# EAGLE design MINI_SAM_D51_015 (EAGLE 9.1.3)
BUILD: 2018/01; DESIGNER: BENJAMIN SHOCKLEY; REV: A
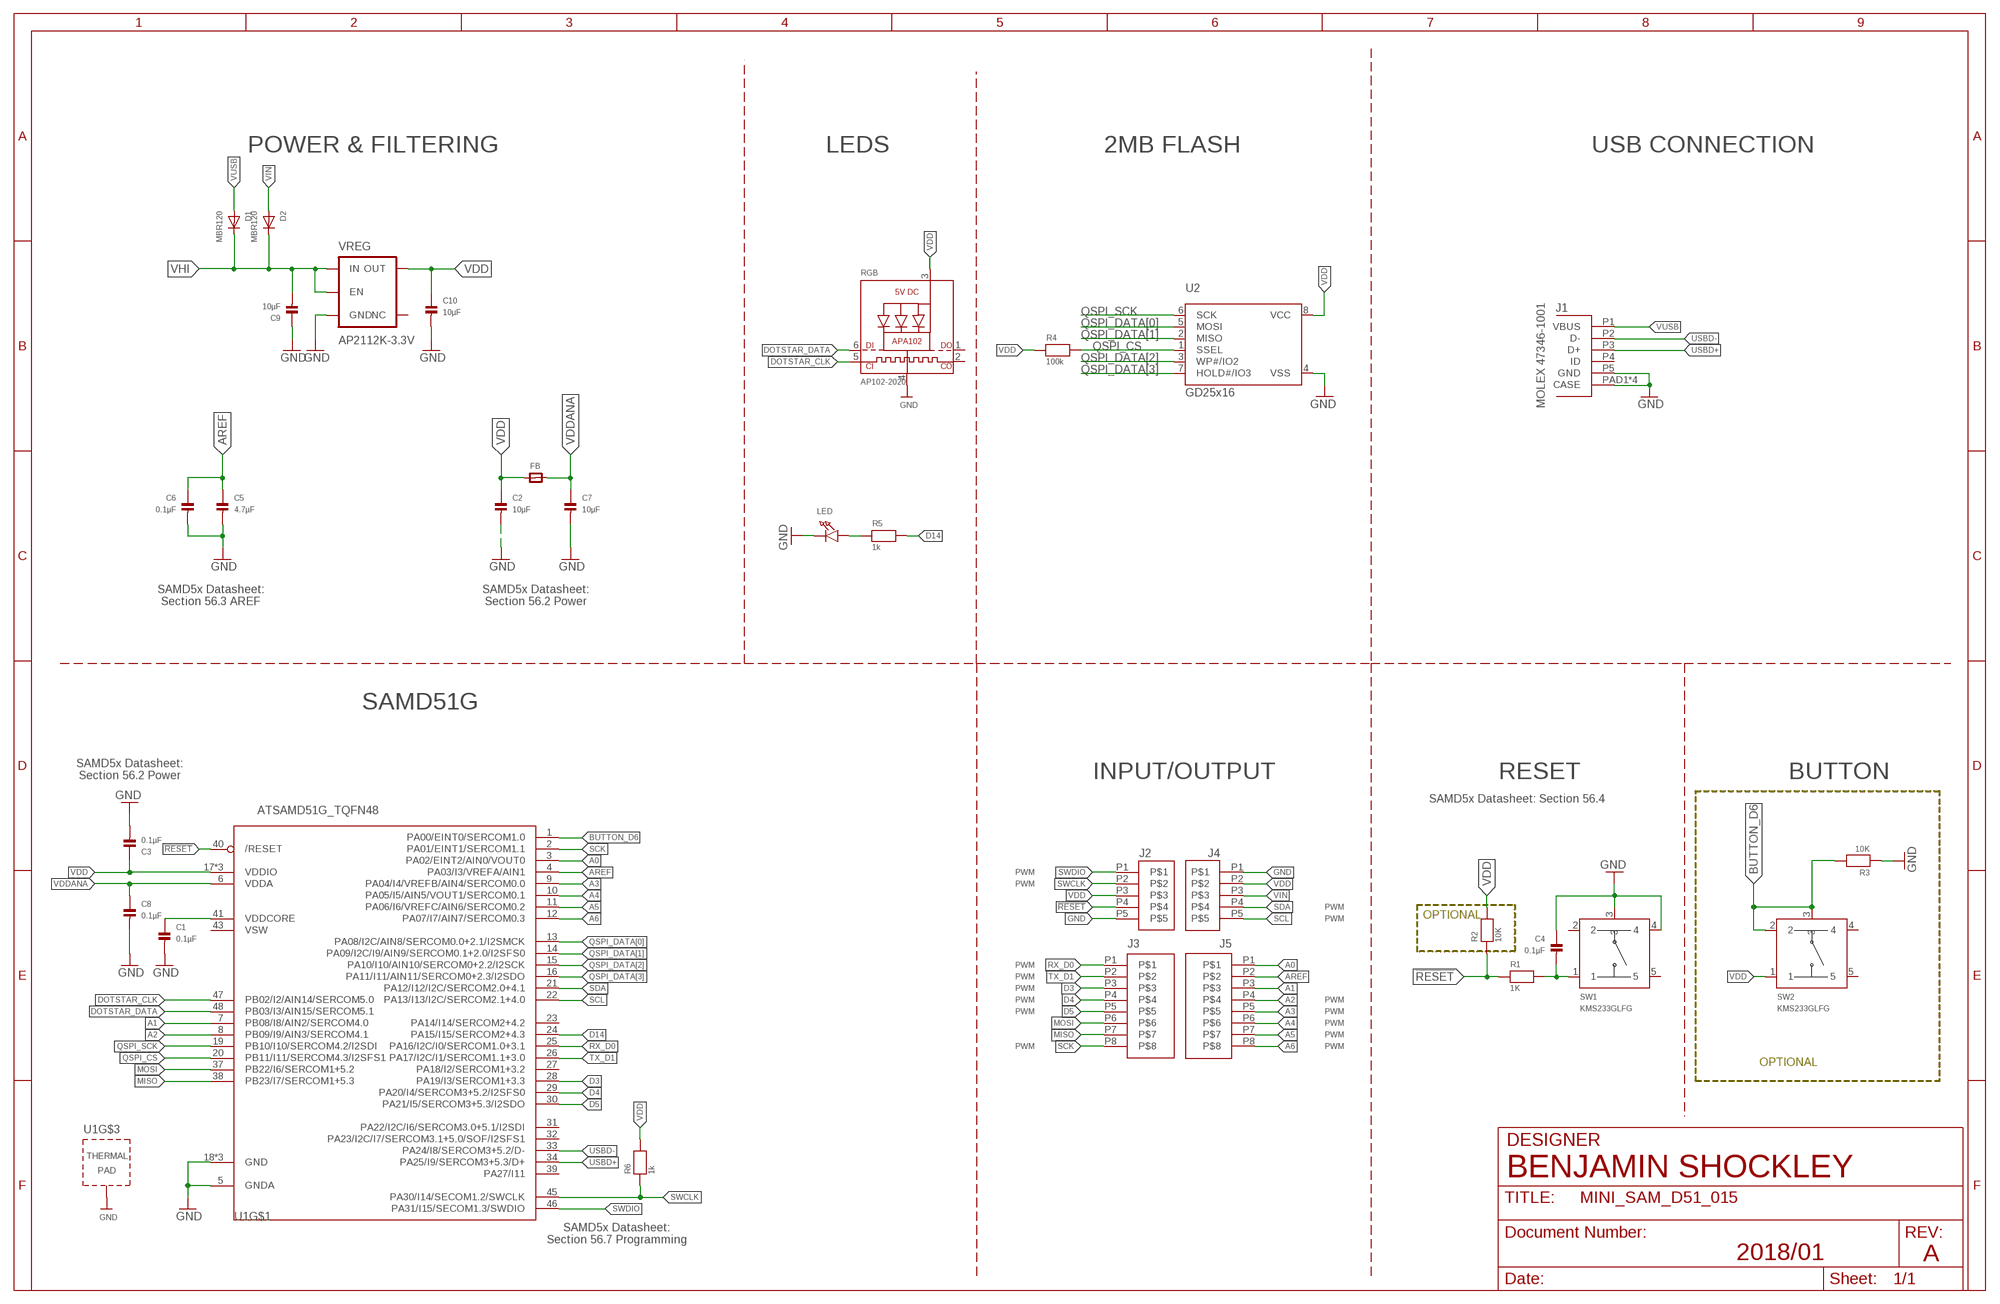
[diagram p0: schematic, sheet 1]

## Parts
C1  0.1µF  CAP_CERAMIC_0603MP  [_0603MP]
C2  10µF  CAP_CERAMIC_0603MP  [_0603MP]
C3  0.1µF  CAP_CERAMIC_0603MP  [_0603MP]
C4  0.1µF  CAP_CERAMIC_0603MP  [_0603MP]
C5  4.7µF  CAP_CERAMIC_0603MP  [_0603MP]
C6  0.1µF  CAP_CERAMIC_0603MP  [_0603MP]
C7  10µF  CAP_CERAMIC_0603MP  [_0603MP]
C8  0.1µF  CAP_CERAMIC_0603MP  [_0603MP]
C9  10µF  CAP_CERAMIC_0603MP  [_0603MP]
C10  10µF  CAP_CERAMIC_0603MP  [_0603MP]
D1  MBR120  DIODE_SOD-123FL  [SOD-123FL]
D2  MBR120  DIODE_SOD-123FL  [SOD-123FL]
FB  FERRITE_0603MP  [_0603MP]
J1  MOLEX_47346-100147346  [MOLEX_47346-1001]
J2  1X5_HEADER_1.27MMCAST  [1X5_HEADER_1.27MM_CASTELLATED]
J3  1X8_HEADER_1.27MMCAST  [1X8_HEADER_1.27MM_CASTELLATED]
J4  1X5_HEADER_1.27MMCAST  [1X5_HEADER_1.27MM_CASTELLATED]
J5  1X8_HEADER_1.27MMCAST  [1X8_HEADER_1.27MM_CASTELLATED]
LED  LED0805_NOOUTLINE  [CHIPLED_0805_NOOUTLINE]
R1  1K  RESISTOR_0603MP  [_0603MP]
R2  10K  RESISTOR_0603MP  [_0603MP]
R3  10K  RESISTOR_0603MP  [_0603MP]
R4  100k  RESISTOR_0603MP  [_0603MP]
R5  1k  RESISTOR_0603MP  [_0603MP]
R6  1k  RESISTOR_0603MP  [_0603MP]
RGB  AP102-2020  APA1022020  [APA102_2020]
SW1  KMS233GLFG  KMS_SWITCHKMS  [KMS_SWITCH]
SW2  KMS233GLFG  KMS_SWITCHKMS  [KMS_SWITCH]
U1  ATSAMD51G_TQFN48  [TQFN48_7MM]
U2  GD25x16  SPIFLASH_8PINUX  [USON8]
VREG  AP2112K-3.3V  V_REG_AP2112K-3.3V  [SOT23-5]

## Nets
!RESET: J2.P4 R1.1 R2.1 U1.40(/RESET)
A0: J5.P1 U1.3(PA02/EINT2/AIN0/VOUT0)
A1: J5.P3 U1.7(PB08/I8/AIN2/SERCOM4.0)
A2: J5.P4 U1.8(PB09/I9/AIN3/SERCOM4.1)
A3: J5.P5 U1.9(PA04/I4/VREFB/AIN4/SERCOM0.0)
A4: J5.P6 U1.10(PA05/I5/AIN5/VOUT1/SERCOM0.1)
A5: J5.P7 U1.11(PA06/I6/VREFC/AIN6/SERCOM0.2)
A6: J5.P8 U1.12(PA07/I7/AIN7/SERCOM0.3)
AREF: C5.1 C6.1 J5.P2 U1.4(PA03/I3/VREFA/AIN1)
BUTTON_D6: R3.2 SW2.2 SW2.3 U1.1(PA00/EINT0/SERCOM1.0)
D3: J3.P3 U1.28(PA19/I3/SERCOM1+3.3)
D4: J3.P4 U1.29(PA20/I4/SERCOM3+5.2/I2SFS0)
D5: J3.P5 U1.30(PA21/I5/SERCOM3+5.3/I2SDO)
D14: R5.2 U1.24(PA15/I15/SERCOM2+4.3)
DOTSTAR_CLK: RGB.5(CKI) U1.47(PB02/I2/AIN14/SERCOM5.0)
DOTSTAR_DATA: RGB.6(DI) U1.48(PB03/I3/AIN15/SERCOM5.1)
GND: C1.2 C2.2 C3.2 C4.1 C5.2 C6.2 C7.2 C8.2 C9.1 C10.2 J1.P5(GND) J1.PAD1(CASE) J1.PAD2(CASE) J1.PAD3(CASE) J1.PAD4(CASE) J2.P5 J4.P1 LED.C R3.1 RGB.4(GND) SW1.3 SW1.4 U1.5(GNDA) U1.18(GND) U1.35(GND) U1.42(GND) U1.THERMAL(TP) U2.4(VSS) VREG.2(GND)
MISO: J3.P7 U1.38(PB23/I7/SERCOM1+5.3)
MOSI: J3.P6 U1.37(PB22/I6/SERCOM1+5.2)
N$3: LED.A R5.1
N$4: C4.2 R1.2 SW1.1
N$9: C1.1 U1.41(VDDCORE)
QSPI_CS: R4.2 U1.20(PB11/I11/SERCOM4.3/I2SFS1) U2.1(SSEL)
QSPI_DATA[0]: U1.13(PA08/I2C/AIN8/SERCOM0.0+2.1/I2SMCK) U2.5(MOSI)
QSPI_DATA[1]: U1.14(PA09/I2C/I9/AIN9/SERCOM0.1+2.0/I2SFS0) U2.2(MISO)
QSPI_DATA[2]: U1.15(PA10/I10/AIN10/SERCOM0+2.2/I2SCK) U2.3(WP#/IO2)
QSPI_DATA[3]: U1.16(PA11/I11/AIN11/SERCOM0+2.3/I2SDO) U2.7(HOLD#/IO3)
QSPI_SCK: U1.19(PB10/I10/SERCOM4.2/I2SDI) U2.6(SCK)
RX_D0: J3.P1 U1.25(PA16/I2C/I0/SERCOM1.0+3.1)
SCK: J3.P8 U1.2(PA01/EINT1/SERCOM1.1)
SCL: J4.P5 U1.22(PA13/I13/I2C/SERCOM2.1+4.0)
SDA: J4.P4 U1.21(PA12/I12/I2C/SERCOM2.0+4.1)
SWCLK: J2.P2 R6.1 U1.45(PA30/I14/SECOM1.2/SWCLK)
SWDIO: J2.P1 U1.46(PA31/I15/SECOM1.3/SWDIO)
TX_D1: J3.P2 U1.26(PA17/I2C/I1/SERCOM1.1+3.0)
USBD+ [USB_DATA]: J1.P3(D+) U1.34(PA25/I9/SERCOM3+5.3/D+)
USBD- [USB_DATA]: J1.P2(D-) U1.33(PA24/I8/SERCOM3+5.2/D-)
VDD: C2.1 C3.1 C10.1 FB.1 J2.P3 J4.P2 R2.2 R4.1 R6.2 RGB.3(VDD) SW2.1 U1.17(VDDIO) U1.36(VDDIO) U1.44(VDDIO) U2.8(VCC) VREG.5(OUT)
VDDANA: C7.1 C8.1 FB.2 U1.6(VDDA)
VHI: C9.2 D1.C D2.C VREG.1(IN) VREG.3(EN)
VIN: D2.A J4.P3
VUSB: D1.A J1.P1(VBUS)
Unconnected: J1.P4(ID) RGB.1(DO) RGB.2(CKO) SW1.2 SW1.5 SW2.4 SW2.5 U1.23(PA14/I14/SERCOM2+4.2) U1.27(PA18/I2/SERCOM1+3.2) U1.31(PA22/I2C/I6/SERCOM3.0+5.1/I2SDI) U1.32(PA23/I2C/I7/SERCOM3.1+5.0/SOF/I2SFS1) U1.39(PA27/I11) VREG.4(NC)

## Notes on the sheet
- POWER & FILTERING | LEDS | 2MB FLASH | USB CONNECTION
- MOLEX 47346-1001
- SAMD5x Datasheet:
  Section 56.3 AREF
- SAMD5x Datasheet:
  Section 56.2 Power
- SAMD51G
- SAMD5x Datasheet:
  Section 56.2 Power
- INPUT/OUTPUT | RESET | BUTTON
- SAMD5x Datasheet: Section 56.4
- SPI:
   SERCOM1  SCK.1, MOSI.2, MISO.3
  
  I2C:
   SERCOM2  SDA.0, SCL.1
  
  UART:
   SERCOM3  TX.0, RX.1
- PWM
- PWM
- PWM
- OPTIONAL
- PWM
- PWM
- PWM
- PWM
- PWM | PWM
- PWM | PWM
- PWM
- PWM
- PWM | PWM
- OPTIONAL
- DESIGNER
- SAMD5x Datasheet:
  Section 56.7 Programming

## Power pins joined to a net without a drawn wire
VSW: U1.43(VSW)

## Library data of the parts
C1-C10 = microbuilder:CAP_CERAMIC: Ceramic Capacitors 0402 - 0402 Surface Mount Capacitors 16pF 50V 5% [Digikey: 445-4899-2-ND] 18pF 50V 5% [Digikey: 490-1281-2-ND] 22pF 50V 5% [Digikey: 490-1283-2-ND] 68pF 50V 5% [Digikey: 490-1289-2-ND] 0.1uF 10V 10% [Digikey: 490-1318-2-ND] 1.0uF 6.3V 10% [Digikey: 490-1320-2-ND] 0603 - 0603 Surface Mount Capacitors 16 pF 50V 5% [Digikey: 445-5051-2-ND] 22 pF 50V [Digikey: PCC220ACVTR-ND] 33 pF 50V 5% [Digikey: 490-1415-1-ND] 56pF 50V 5% [Digikey: 490-1421-1-ND] 220pF 50V 5% [Digikey: 445-1285-1-ND] 680 pF 50V 2200 pF 50V 5% C0G [Digikey: 445-1297-1-ND] 5600 pF 100V 5% X7R [Digikey: 478-3711-1-ND] 0.1 µF 25V 10% [Digikey: PCC2277TR-ND] 0.22 µF 16V 10% X7R [Digikey: 445-1318-1-ND] 1.0 µF 25V 10% [Digikey: 445-5146-2-ND] 0603 - RF Specific 3pF 250V +/-0.1pF RF [Digikey: 712-1347-1-ND] 18 pF 250V 5% [Digikey: 478-3505-1-ND or 712-1322-1-ND] 56 pF 250V 5% C0G RF [Digikey: 490-4867-1-ND] 68 pF 250V RF [Digikey: 490-4868-1-ND] 0805 - 0805 Surface Mount Capacitors 220 pF 250V 2% RF Ceramic Capacitor [Digikey: 712-1398-1-ND] 1000 pF 50V 2% NP0 Ceramic Capacitor [Digikey: 478-3760-1-ND] 0.1 µF 25V 10% Ceramic Capacitor [Digikey: PCC1828TR-ND] 1.0 µF 16V 10% Ceramic Capacitor[Digikey: 490-1691-2-ND] 10.0 µF 10V 10% Ceramic Capacitor[Digikey: 709-1228-1-ND] 10.0 uF 16V 10% Ceramic Capacitor [Digikey: 478-5165-2-ND] 47 uF 6.3V 20% Ceramic Capacitor [Digikey: 587-1779-1-ND or 399-5506-1-ND] 1206 - 1206 Surface Mount Capacitors 47uF 10V 20% Ceramic Capacitor [Digikey: 490-5528-1-ND or 399-5508-1-ND or 445-6010-1-ND] 100uF 6.3V -20%, +80% Y5V Ceramic Capacitor (Digikey: 490-4512-1-ND, Mouser: 81-GRM31CF50J107ZE1L)
D1 D2 = adafruit:DIODE: Diode SMADIODE - SMA Surface Mount Package 20V 1A Schottky Diode Digikey: 641-1014-6-ND DO-1N4148 - Through Hole Small Current Diode SOD-123 20V 1 A (.5mV Vf) Schottky Diode - Digikey: MBRX120TPMSCT-ND SOD-323 10V 570mA (.38mV Vf, 3ns) Schottky Diode - Digikey: ZLLS410CT-ND SOD-523 30V 30mA Schottky Diode (RB751S-40TE61) - Digikey: RB751S-40TE61CT-ND SOT23-R/W - SOT23 Package (R = Solder Paste/Reflow Ovens, W = Hand-Soldering) BAT54Film 40V 300mA - Digikey: 497-7162-1-ND
FB = microbuilder:FERRITE: Ferrite Bead 0603 MMZ1608B121C - 120 Ohm @ 100MHz, 600mA, 0.15 Ohm DC Resistance - Digikey: 445-2164-1-ND BK1608HW121-T - 120 Ohm, 600mA Ferrite Chip - Digikey: 587-1876-2-ND 0805 HZ0805B272R-10 - 2.7K Ohm @ 100MHz, 200mA, 0.8 Ohm DC Resistance - Digikey: 240-2504-1-ND (see also Murata BLM21BD272SN1L) MMZ2012Y152B - 1.5K Ohm @ 100MHz, 500mA, 0.4 Ohm DC Resistance - Digikey: 445-1560-1-ND - Mainly for high frequency (80-400MHz) MMZ2012R102A - 1K Ohm @ 100MHz, 500mA, 0.3 Ohm DC Resistance - Digikey: 445-1555-2-ND - More general purpose (10-200MHz)
J1 = Shockley_Custom:MOLEX_47346-1001
J2 J4 = Shockley_Custom:1X5_HEADER_1.27MM
J3 J5 = Shockley_Custom:1X8_HEADER_1.27MM
LED = microbuilder:LED: LED 0603 - 0603 Surface Mount Package 2mA: Green LED - Low Power (3.9mcd, 2ma, 1.7Vf) - Digikey: 475-2709-2-ND Orange LED - Low Power (9.8mcd, 2ma, 1.8Vf) - Digikey: 475-1194-2-ND Red LED - Low Power (5mcd, 2ma, 1.8Vf) - Digikey: 475-1195-2-ND Yellow LED - Low Power (7mcd, 2ma, 1.8Vf) - Digikey: 475-1196-2-ND 5mA: Blue LED - Low Power (17mcd, 5ma, 2.9Vf) - Digikey: LNJ937W8CRACT-ND 0805 - 0805 Surface Mount Package 2mA: Red LED (8.8mcd, 2mA, 1.8Vf, Clear) - Low Power [Digikey: 475-2510-1-ND] Green LED (5mcd, 2mA, 1.8Vf, Clear) - Low Power [Digikey: 475-2730-1-ND] Yellow LED (11.3mcd, 2mA, 1.8Vf, Clear) - Low Power [Digikey: 475-2555-1-ND] 20mA: Red LED (104mcd, 20mA, Diffused) - LS R976 [Digikey: 475-1278-6-ND] Red LED (12mcd, 20mA, 2.0Vf, Clear) - APT2012EC [Digikey: 754-1128-1-ND] Green LED (15mcd, 20mA, 2.2Vf, Clear) - APT2012GC [Digikey: 754-1131-1-ND] Orange LED (160mcd, 20mA, 2.1Vf, Clear) - APT2012SECK [Digikey: 754-1130-1-ND] 1206 - 1206 Surface Mount Package Green LED (26mcd, 20mA, Diffused) - LG N971 [Digikey: 475-1407-6-ND] Red LED (15mcd, 20mA, Diffused) - LH N974 [Digikey: 475-1416-6-ND]
R1-R6 = microbuilder:RESISTOR: Resistors 0402 - 0402 Surface Mount Package 22 Ohm 1% 1/16W [Digikey: 311-22.0LRTR-ND] 33 Ohm 5% 1/16W 1.0K 5% 1/16W 1.5K 5% 1/16W 2.0K 1% 1/16W 10.0K 1% 1/16W [Digikey: 311-10.0KLRTR-ND] 10.0K 5% 1/16W [Digikey: RMCF0402JT10K0TR-ND] 12.1K 1% 1/16W [Digikey: 311-22.0LRTR-ND] 100.0K 5% 1/16W 0603 - 0603 Surface Mount Package 0 Ohm 1/10 Watt 1% Resistor 15 Ohm 1/10 Watt 1% Resistor 33 Ohm 1/10 Watt 1% Resistor 49.9 Ohm 1/10 Watt 1% Resistor 100 Ohm 1/10 Watt 1% Resistor 150 Ohm 1/10 Watt 1% Resistor 240 Ohm 1/10 Watt 1% Resistor 390 Ohm 1/10 Watt 1% Resistor 560 Ohm 1/10 Watt 1% Resistor 680 Ohm 1/10 Watt 1% Resistor 750 Ohm 1/10 Watt 1% Resistor 1.0K Ohm 1/10 Watt 1% Resistor 1.5K Ohm 1/10 Watt 1% Resistor 2.0K Ohm 1/10 Watt 1% Resistor 2.2K Ohm 1/10 Watt 1% Resistor 3.3K Ohm 1/10 Watt 1% Resistor 4.7K Ohm 1/10 Watt 1% Resistor 10.0K Ohm 1/10 Watt 1% Resistor 12.0K Ohm 1/10 Watt 1% Resistor 12.1K Ohm 1/10 Watt 1% Resistor 20.0K Ohm 1/10 Watt 1% Resistor 33.0K Ohm 1/10 Watt 1% Resistor 100.0K Ohm 1/10 Watt 1% Resistor 0805 - 0805 Surface Mount Package 0 Ohm 1/8 Watt 1% Resistor 33 Ohm 1/8 Watt 1% Resistor 100 Ohm 1/8 Watt 1% Resistor 150 Ohm 1/8 Watt 1% Resistor 200 Ohm 1/8 Watt 1% Resistor 240 Ohm 1/8 Watt 1% Resistor 330 Ohm 1/8 Watt 1% Resistor 390 Ohm 1/8 Watt 1% Resistor 470 Ohm 1/8 Watt 1% Resistor 1.0K Ohm 1/8 Watt 1% Resistor 1.5K Ohm 1/8 Watt 1% Resistor 2.0K Ohm 1/8 Watt 1% Resistor 4.7K Ohm 1/8 Watt 1% Resistor 5.1K Ohm 1/8 Watt 1% Resistor 5.6K Ohm 1/8 Watt 1% Resistor 10.0K Ohm 1/8 Watt 1% Resistor 22.0K Ohm 1/8 Watt 1% Resistor 33.0K Ohm 1/8 Watt 1% Resistor 100K Ohm 1/8 Watt 1% Resistor 1206 - 1206 Surface Mount Package 2012 - 2010 Surface Mount Package 0.11 Ohm 1/2 Watt 1% Resistor - Digikey: RHM.11UCT-ND
RGB = microbuilder:APA102: APA102/DotStar Pixels VCC: 5V DC Refresh Rate: 400Hz
SW1 SW2 = Shockley_Custom:KMS_SWITCH
U1 = microbuilder:ATSAMD51G
U2 = microbuilder:SPIFLASH_8PIN: SOIC8 SPI Flash Be careful with the size since SOIC8 flash comes in several 'widths' SOIC8 150 mil M25P16 - 16Mbit (2Mbit x 8) Serial Flash (75MHz SPI Bus), Supply: 2.7-3.6V Digikey: SOIC8 - M25P16-VMN6P-ND SOIC8 208 mil W25Q16BVSSIG - 16Mbit (2Mbit x 8) Serial Flash (104MHz SPI Bus), Supply: 2.7-3.6V Digikey: SOIC8 - W25Q16BVSSIG-ND
VREG = SparkFun-PowerIC:V_REG_AP2112: AP2112 - 600mA CMOS LDO Regulator w/ Enable The AP2112 is CMOS process low dropout linear regulator with enable function, the regulator delivers a guaranteed 600mA (min.) continuous load current. Features Output Voltage Accuracy: ±1.5% Output Current: 600mA (Min.) Foldback Short Current Protection: 50mA Enable Function to Turn ON/OFF VOUT Low Dropout Voltage (3.3V): 250mV (Typ.) @IOUT=600mA Excellent Load Regulation: 0.2%/A (Typ.) Excellent Line Regulation: 0.02%/V (Typ.) Low Quiescent Current: 55μA (Typ.) Low Standby Current: 0.01μA (Typ.) Low Output Noise: 50μVRMS PSRR: 100Hz -65dB, 1kHz -65dB OTSD Protection Stable with 1.0μF Flexible Cap: Ceramic, Tantalum and Aluminum Electrolytic Operation Temperature Range: -40°C to 85°C ESD: MM 400V, HBM 4000V; PROD_ID: VREG-12457; VALUE: 3.3V

## Board
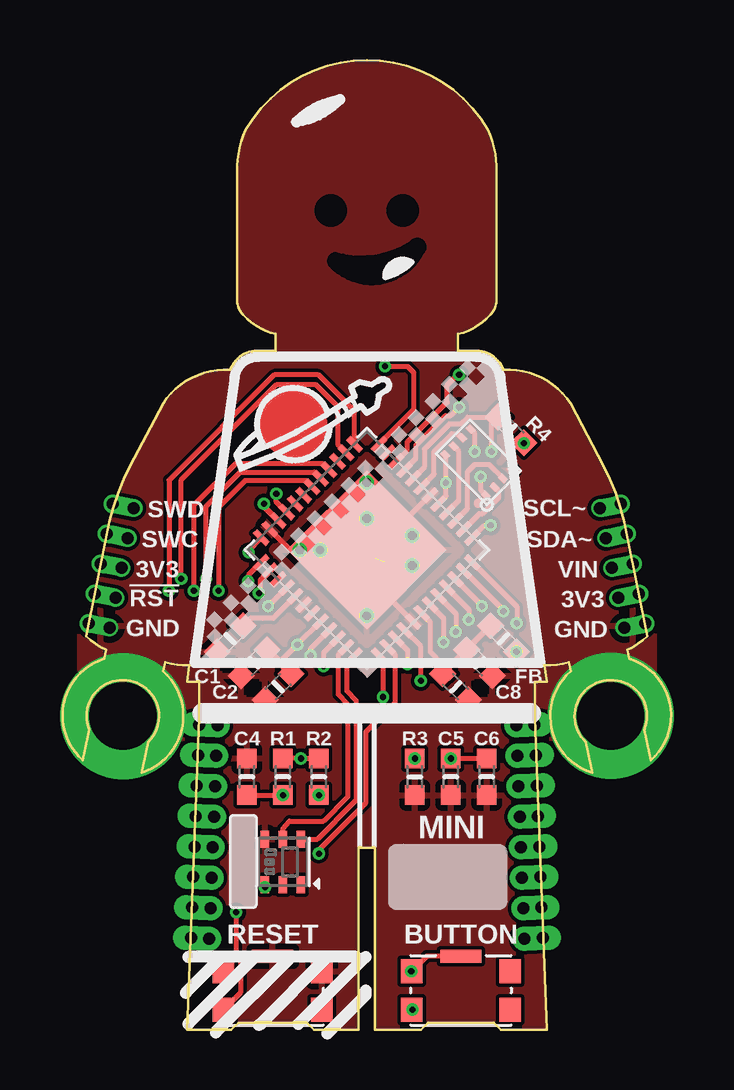
[diagram p1: board, top side]
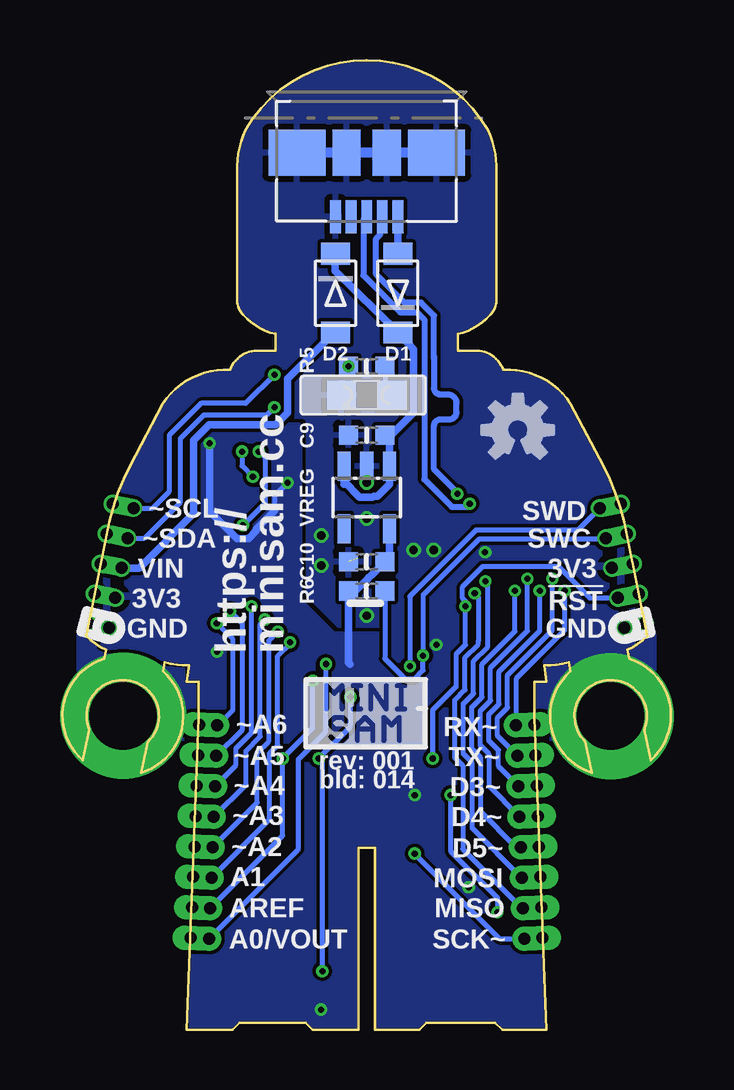
[diagram p2: board, bottom side, seen from below]

Size 25.38 x 40.42 mm. Coordinates in mm from the lower left corner, seen from the top.
Outline: 7.54,29.8 arc-40 7.29,30.3
Outline: 7.29,30.3 7.29,36
Outline: 18.09,30.3 18.09,36
Outline: 7.64,37.5 arc-120 17.74,37.5
Outline: 7.29,36 arc-25 7.64,37.5
Outline: 18.09,36 arc25 17.74,37.5
Outline: 7.54,29.8 arc35 8.89,29
Outline: 17.84,29.8 arc40 18.09,30.3
Outline: 17.84,29.8 arc-35 16.49,29
Outline: 8.01,28.3 arc63 6.99,27.5
Outline: 18.39,27.5 arc63 17.37,28.3
Outline: 6.99,27.5 arc60 4.19,26.1 2.82,23.5 arc18 1.83,20.54 0.99,16.4 arc15 1.82,15.83 1.75,15.46 arc122 0.85,11.24 1.12,12.52 arc-125 2.83,14.54 arc-125 3.56,12
Outline: 18.39,27.5 arc-60 21.19,26.1 22.55,23.5 arc-18 23.55,20.54 24.39,16.4 arc-15 23.55,15.83 23.63,15.46 arc-122 24.53,11.24 24.26,12.52 arc125 22.55,14.54 arc125 21.81,12 22.08,10.72 arc-122 21.19,14.95 21.11,15.31 arc-15 20.09,15.2 20.19,14.5 19.69,14.5 19.69,13 20.19,0 18.29,0 17.99,0.3 15.24,0.3 14.94,0 13.04,0 13.04,7.6 12.34,7.6 12.34,0 10.49,0 10.19,0.3 7.34,0.3 7.04,0 5.19,0 5.69,13 5.69,14.5 5.19,14.5 5.29,15.2 arc-15 4.27,15.31 4.19,14.95 arc-122 3.29,10.72
Outline: 3.56,12 3.29,10.72
Outline: 3.56,12 3.29,10.72
Outline: 8.01,28.3 8.69,28.3 8.89,28.3 8.89,29
Outline: 8.01,28.3 arc63 6.99,27.5
Outline: 18.39,27.5 arc63 17.37,28.3
Outline: 17.37,28.3 16.69,28.3 16.49,28.3 16.49,29
Outline: 7.54,29.8 arc-40 7.29,30.3
Outline: 7.29,30.3 7.29,36
Outline: 18.09,30.3 18.09,36
Outline: 7.64,37.5 arc-120 17.74,37.5
Outline: 7.29,36 arc-25 7.64,37.5
Outline: 18.09,36 arc25 17.74,37.5
Outline: 7.54,29.8 arc35 8.89,29
Outline: 17.84,29.8 arc40 18.09,30.3
Outline: 17.84,29.8 arc-35 16.49,29
Copper layers (1*16): Top 0.035559375mm / dielectric 1.6mm / Bottom 0.035559375mm
Design rules "oshpark-2layer-tented *": minimum track width 6mil, minimum drill 10mil, track to track 6mil, track to pad 6mil, pad to pad 6mil, via to via 6mil, smd to smd 6mil, copper to edge 0.5mil, drill to drill 6mil, minimum pad ring 5mil, minimum via ring 5mil, stop-mask expansion 2.5mil, vias tented up to drill 20mil, thermal gap 10mil
tRestrict: area 11.1,31.2 to 15,32.9; area 10.9,33.9 to 11.5,34.4; area 13.9,33.9 to 14.5,34.4; area 12.2,25.9 to 13.4,26.9; area 13.3,26.8 to 13.4,26.9; 5 lines
bRestrict: area 12.3,25.8 to 13.1,27.1

### Footprints (pad centres in the part's own frame; a part is rotated, then mirrored left to right if it is on the bottom)
_0603MP = smd 0.8 x 0.8: 1 -0.762,0; 2 0.762,0
SOD-123FL = smd 0.91 x 1.22: A 1.637,0; C -1.637,0
MOLEX_47346-1001 = smd 0.45 x 1.38: P1 1.3,-2.66; P2 0.65,-2.66; P3 0,-2.66; P4 -0.65,-2.66; P5 -1.3,-2.66 | smd 2.375 x 1.9: PAD1 -2.913,0; PAD4 2.913,0 | smd 1.175 x 1.9: PAD2 -0.838,0; PAD3 0.838,0
1X5_HEADER_1.27MM_CASTELLATED = drill 0.5 offset: P1 -2.54,0; P2 -1.27,0; P3 0,0; P4 1.27,0; P5 2.54,0 | drill 0.5: P$1 -2.54,-0.889; P$2 -1.27,-0.889; P$3 0,-0.889; P$4 1.27,-0.889; P$5 2.54,-0.889
1X8_HEADER_1.27MM_CASTELLATED = drill 0.5 pad 1.016 offset: P1 -4.445,0; P2 -3.175,0; P3 -1.905,0; P4 -0.635,0; P5 0.635,0; P6 1.905,0; P7 3.175,0; P8 4.445,0 | drill 0.5: P$1 -4.445,-0.762; P$2 -3.175,-0.762; P$3 -1.905,-0.762; P$4 -0.635,-0.762; P$5 0.635,-0.762; P$6 1.905,-0.762; P$7 3.175,-0.762; P$8 4.445,-0.762
CHIPLED_0805_NOOUTLINE = smd 1.2 x 1.2: A 0,-1.05; C 0,1.05
APA102_2020 = smd 0.7 x 0.35: 1 -0.95,-0.75; 2 -0.95,0; 3 -0.95,0.75; 4 0.95,0.75; 5 0.95,0; 6 0.95,-0.75
KMS_SWITCH = smd 0.9 x 1: 1 -2.05,-0.8; 2 -2.05,0.8; 4 2.05,0.8; 5 2.05,-0.8 | smd 1.7 x 0.55: 3 0,1.425
TQFN48_7MM = smd 0.25 x 0.75: 1 -2.75,-3.475; 2 -2.25,-3.475; 3 -1.75,-3.475; 4 -1.25,-3.475; 5 -0.75,-3.475; 6 -0.25,-3.475; 7 0.25,-3.475; 8 0.75,-3.475; 9 1.25,-3.475; 10 1.75,-3.475; 11 2.25,-3.475; 12 2.75,-3.475; 25 2.75,3.475; 26 2.25,3.475; 27 1.75,3.475; 28 1.25,3.475; 29 0.75,3.475; 30 0.25,3.475; 31 -0.25,3.475; 32 -0.75,3.475; 33 -1.25,3.475; 34 -1.75,3.475; 35 -2.25,3.475; 36 -2.75,3.475 | smd 0.75 x 0.25: 13 3.475,-2.75; 14 3.475,-2.25; 15 3.475,-1.75; 16 3.475,-1.25; 17 3.475,-0.75; 18 3.475,-0.25; 19 3.475,0.25; 20 3.475,0.75; 21 3.475,1.25; 22 3.475,1.75; 23 3.475,2.25; 24 3.475,2.75; 37 -3.475,2.75; 38 -3.475,2.25; 39 -3.475,1.75; 40 -3.475,1.25; 41 -3.475,0.75; 42 -3.475,0.25; 43 -3.475,-0.25; 44 -3.475,-0.75; 45 -3.475,-1.25; 46 -3.475,-1.75; 47 -3.475,-2.25; 48 -3.475,-2.75 | smd 4.7 x 4.7: THERMAL 0,0
USON8 = smd 0.35 x 0.25: 1 -1.2,0.75; 2 -1.2,0.25; 3 -1.2,-0.25; 4 -1.2,-0.75; 5 1.2,-0.75; 6 1.2,-0.25; 7 1.2,0.25; 8 1.2,0.75
SOT23-5 = smd 0.55 x 1.2: 1 -0.95,-1.3; 2 0,-1.3; 3 0.95,-1.3; 4 0.95,1.3; 5 -0.95,1.3

### Placement (x,y rotation side)
C1  6.99,16.3 225 top
C2  7.99,15.3 225 top
C3  8.99,14.3 225 top
C4  7.69,10.55 270 top
C5  16.19,10.55 270 top
C6  17.69,10.55 270 top
C7  16.39,14.3 315 top
C8  17.39,15.3 315 top
C9  12.69,24.78 0 bottom
C10  12.69,19.51 180 bottom
D1  11.39,30.7 90 bottom
D2  13.99,30.7 270 bottom
FB  18.39,16.3 135 top
J1  12.69,36.55 0 bottom
J2  2.46,19.25 258.5 top
J3  6.29,8.25 267.8 top
J4  22.91,19.25 101.5 top
J5  19.09,8.25 92.2 top
LED  12.69,26.45 90 bottom
R1  9.19,10.55 270 top
R2  10.69,10.55 270 top
R3  14.69,10.55 90 top
R4  18.69,25 135 top
R5  12.69,27.65 180 bottom
R6  12.69,18.29 180 bottom
RGB  9.19,7 90 top
SW1  8.76,1.65 0 top
SW2  16.61,1.65 0 top
U1  12.69,20 45 top
U2  17.34,23.65 135 top
U$3  [OSHW-LOGO-S]  6.39,25 0 bottom
VREG  12.69,22.19 180 bottom

### Tracks (layer width: path | path; a pad name or v marks a point on that pad's centre or on a via)
!RESET  (via drill 0.25)
  Top 0.203: U1.40 v8.57,17.65 | R2.1 v9.94,11.31 R1.1
  Bottom 0.203: v9.94,11.31 9.94,13.32 8.95,14.31 8.95,15.67 8.57,16.05 v8.57,17.65 8.57,17.86 8.7,17.99 8.7,18.46 7.85,19.31 4.7,19.31 3.39,18 J2.P4
A0  (via drill 0.25)
  Top 0.203: U1.3 14.39,15.82 v14.39,15.25
  Bottom 0.203: J5.P1 15.55,7.51 15.53,7.54 15.53,11.29 14.39,12.43 v14.39,15.25
A1  (via drill 0.25)
  Top 0.203: U1.7 15.89,17.15 v15.89,16.15
  Bottom 0.203: v15.89,16.15 15.89,16.1 16.4,15.59 16.4,11.87 16.73,11.54 16.73,8.78 J5.P3
A2  (via drill 0.25)
  Top 0.203: U1.8 16.4,17.35 v16.4,16.59
  Bottom 0.203: v16.4,16.59 16.77,16.22 16.77,12.04 17.25,11.55 17.25,9.47 J5.P4
A3  (via drill 0.25)
  Top 0.203: U1.9 16.94,17.52 v16.94,17.1
  Bottom 0.203: v16.94,17.1 17.13,16.91 17.13,12.22 17.73,11.62 17.73,10.22 J5.P5
A4  (via drill 0.25)
  Top 0.203: U1.10 17.49,17.68 v17.49,17.65
  Bottom 0.203: v17.49,17.65 17.49,12.38 18.14,11.73 18.14,11.03 J5.P6
A5  (via drill 0.25)
  Top 0.203: U1.11 18.39,17.48 v18.39,17.45
  Bottom 0.203: J5.P7 17.87,12.52 17.87,16.93 v18.39,17.45
A6  (via drill 0.25)
  Top 0.203: U1.12 18.94,17.64 v18.94,16.95
  Bottom 0.203: v18.94,16.95 18.27,16.28 18.27,13.34 J5.P8
AREF  (via drill 0.25)
  Top 0.203: C5.1 C6.1 | v14.94,14.55 14.94,15.98 U1.4
  Bottom 0.203: J5.P2 16.19,8.1 C5.1 14.94,12.56 v14.94,14.55
  other vias: 16.19,11.31
BUTTON_D6  (via drill 0.25)
  Top 0.203: v13.37,13.88 13.37,15.43 U1.1 | SW2.3 15.19,3.08 SW2.2 v14.54,2.45
  Bottom 0.203: v13.37,13.88 13.37,12.63 R3.2 14.54,11.16 v14.54,2.45
  other vias: 14.69,11.31
D3  (via drill 0.25)
  Top 0.203: U1.28 10.86,23.6 7.22,23.6 5.48,21.86 v5.48,18.3 | U1.28
  Bottom 0.203: J3.P3 7.2,10.99 7.2,11.65 7.59,12.05 7.59,13.15 7.17,13.58 7.17,14.94 5.48,16.63 v5.48,18.3
D4  (via drill 0.25)
  Top 0.203: U1.29 10.51,23.24 7.41,23.24 5.98,21.82 v5.98,18.8 | U1.29
  Bottom 0.203: J3.P4 7.58,10.15 7.58,11.48 7.95,11.86 7.95,13.3 7.53,13.72 7.53,15.08 5.98,16.62 v5.98,18.8
D5  (via drill 0.25)
  Top 0.203: U1.30 10.15,22.89 7.61,22.89 6.5,21.78 v6.5,18.3 | U1.30
  Bottom 0.203: v6.5,18.3 6.5,16.61 7.88,15.23 7.88,13.87 8.31,13.45 8.31,11.71 7.93,11.34 7.93,9.08 6.46,7.62 J3.P5
D14  (via drill 0.25)
  Top 0.203: R5.2 14.39,27.65 14.64,27.4 14.64,25.84 U1.24
  other vias: 13.45,27.65
DOTSTAR_CLK
  Top 0.203: RGB.5 9.19,8.39 9.47,8.7 10.87,8.7 11.89,9.71 11.89,13.58 11.49,13.98 11.49,15.62 U1.47
DOTSTAR_DATA
  Top 0.203: 12.14,9.46 10.63,7.95 RGB.6 | U1.48 11.84,15.27 11.84,14.13 12.24,13.73 12.24,9.57 12.14,9.46 | 12.14,9.46
GND  (via drill 0.35, 2.8 pad 5.25)  (1 unrouted)
  Top 0.203: U1.5 13.04,18.59 13.04,19.15 | 13.04,19.65 13.04,20 | U1.18 13.04,20 | 13.04,20 U1.THERMAL | U1.35 10.36,19.15 13.04,19.15 | U1.THERMAL 13.04,19.65 | 13.04,19.65 13.04,19.15 | U1.THERMAL v12.69,17.26
  Bottom 0.203: v12.69,22.81 VREG.2
  Bottom 0.406: J1.PAD4 J1.PAD3 J1.PAD2 J1.PAD1
  other vias: 2.52,13.08 22.85,13.09 12.69,21.3 14.59,19.35 9.89,20 14.59,20.6 10.74,20
  pour Top (rank 2): 5.19,0 20.19,0 20.19,12 21.69,12 21.69,14 22.69,14 22.69,12 24.69,12 24.69,40.35 0.69,40.35 0.69,12 2.69,12 2.69,14 3.69,14 3.69,12 5.19,12
  pour Bottom (rank 2): 10.39,40.25 24.69,40.25 24.69,27.35 24.69,12 20.19,12 20.19,0 5.19,0 5.19,12 3.69,12 3.69,14 2.69,14 2.69,12 0.69,12 0.69,40.25
MISO  (via drill 0.25)
  Top 0.203: U1.38 8.25,18.74 8.25,18.26 v8.19,18.2
  Bottom 0.203: J3.P7 6.19,5.05 8.68,7.54 8.68,11.01 9.02,11.35 9.02,13.74 8.59,14.17 8.59,15.52 8.04,16.08 8.04,16.2 8.04,18.05 v8.19,18.2
MOSI  (via drill 0.25)
  Top 0.203: U1.37 7.74,18.94 v7.74,18.7
  Bottom 0.203: J3.P6 6.23,6.35 8.29,8.4 8.29,11.13 8.66,11.51 8.66,13.6 8.24,14.02 8.24,15.38 7.64,15.98 7.64,18.6 v7.74,18.7
N$3
  Bottom 0.203: R5.1 11.93,26.74 LED.A
N$4  (via drill 0.25)
  Top 0.203: v7.24,4.9 7.24,3.23 7.42,3.06 7.42,1.55 SW1.1 | C4.2 R1.2
  Bottom 0.203: R1.2 9.19,7.45 7.24,5.5 v7.24,4.9
  other vias: 9.19,9.79
N$9
  Top 0.203: U1.41 9.08,17.45 9.08,17.44 8.78,17.15 8.36,17.15 7.84,17.15 C1.1
QSPI_CS  (via drill 0.25)
  Top 0.203: U1.20 15.09,23.45 15.09,24.21 16.12,25.24 16.6,25.24 16.9,25.54 R4.2 17.89,25.28 v17.89,24.1 | U2.1 17.44,22.49 v17.44,23.05
  Bottom 0.203: v17.89,24.1 17.89,23.5 v17.44,23.05
QSPI_DATA[0]  (via drill 0.25)
  Top 0.203: v17.19,24.1 17.19,24.86 U2.5 | U1.13 17.6,21.02 v17.85,21.02
  Bottom 0.203: v17.19,24.1 16.91,23.83 16.91,22.75 16.91,21.96 v17.85,21.02
QSPI_DATA[1]
  Top 0.203: U2.2 18.19,22.45 18.19,22.19 17.51,21.51 17.38,21.51 U1.14
QSPI_DATA[2]
  Top 0.203: U1.15 16.89,21.73 16.89,23.27 17.18,23.56 17.78,23.56 U2.3
QSPI_DATA[3]
  Top 0.203: U1.16 16.53,22.07 16.53,22.75 16.53,24.11 U2.7
QSPI_SCK
  Top 0.203: U1.19 15.49,23.16 15.49,24.11 16.24,24.85 16.49,24.85 U2.6
RX_D0  (via drill 0.25)
  Top 0.203: v4.44,18.3 4.44,22.91 8.83,27.3 10.68,27.3 12.18,25.8 U1.25
  Bottom 0.203: v4.44,18.3 4.44,16.65 6.46,14.63 J3.P1
SCK  (via drill 0.25)
  Top 0.203: U1.2 13.88,15.63 13.88,13.65 12.65,12.42 12.65,9.47 10.69,7.51 v10.69,7.35
  Bottom 0.203: v10.69,7.35 7.15,3.81 J3.P8
SCL  (via drill 0.25)
  Top 0.203: U1.22 14.38,24.16 14.38,24.5 16.03,26.15 16.03,26.86 16.47,27.3 v16.54,27.3
  Bottom 0.203: v16.54,27.3 17.73,26.11 19.6,26.11 20.91,24.8 20.91,22.45 21.62,21.74 J4.P5
SDA  (via drill 0.25)
  Top 0.203: U1.21 14.73,23.81 14.73,24.35 15.98,25.6 16.19,25.6 v16.54,25.95
  Bottom 0.203: v16.54,25.95 16.87,25.62 19.48,25.62 20.45,24.65 20.45,21.99 21.95,20.5 J4.P4
SWCLK  (via drill 0.25)
  Top 0.203: U1.45 10.45,15.99 10.34,15.88 v10.34,15.6
  Bottom 0.203: J2.P2 2.75,20.46 7.99,20.46 10.34,18.12 v10.34,15.6 10.34,14.98 10.68,14.64 11.1,14.64 11.93,15.47 R6.1
SWDIO  (via drill 0.25)
  Top 0.203: U1.46 10.89,15.72 v10.89,15.15
  Bottom 0.203: v10.89,15.15 10.89,18.07 8.14,20.82 3.88,20.83 J2.P1
TX_D1  (via drill 0.25)
  Top 0.203: U1.26 11.49,24.38 11.49,25.96 11.29,26.16 10.55,26.9 8.93,26.9 4.95,22.92 v4.95,18.8
  Bottom 0.203: J3.P2 7.24,12.25 7.24,13.01 6.81,13.43 6.81,14.79 4.95,16.65 v4.95,18.8
U1_P1
  pour Top: 12.7,14.74 13.08,15.11 12.33,15.11
USBD+  (via drill 0.25)
  Top 0.254: U1.34 8.34,21.87 v8.4,21.93
  Bottom 0.254: v8.4,21.93 8.53,21.8 9.14,21.8 10.29,22.94 10.29,29.6 10.59,29.9 11.29,29.9 12.83,31.44 12.83,33.75 J1.P3
USBD-  (via drill 0.25)
  Top 0.203: U1.33 8.91,22.01 v8.91,22.34
  Bottom 0.254: v8.91,22.34 8.91,22.39 9.88,23.36 9.88,25.18 arc90 9.62,25.44 9.26,25.44 arc-90 8.94,25.76 8.94,26.11 arc-90 9.31,26.48 9.61,26.48 arc90 9.88,26.75 9.88,27.75 | 9.88,27.94 9.88,28.07 9.88,27.94 | 9.88,27.94 9.88,27.75 | 9.88,27.94 9.88,27.75 | 9.88,27.94 9.88,29.77 10.42,30.3 11.12,30.3 12.3,31.48 12.3,32.97 12.12,33.15 12.12,33.81 J1.P2
VDD  (via drill 0.25)
  Top 0.203: v19.24,24.45 | R4.1 v19.24,24.45 | U2.8 15.99,23.94 v15.99,22.8 15.99,22.24 U1.17 | SW2.1 v14.59,0.85 | U1.36 7.75,19.98 v7.75,19.9 | U1.44 v9.79,16.05 9.05,15.31
  Top 0.305: C2.1 9.05,15.31 C3.1 | RGB.3 v8.44,5.95
  Bottom 0.203: 16.52,21.63 16.52,22.27 v15.99,22.8
  Bottom 0.305: VREG.5 11.74,19.7 C10.1 12.44,19 12.45,19 12.63,18.82 12.63,18.81 13.15,18.29 R6.2 13.45,15.3 13.39,15.24 | 16.52,21.63 17.29,20.86 17.29,20.79 17.62,20.46 18.08,20.46 19.24,21.62 v19.24,24.45
  other vias: 18.93,15.76 10.69,9.79
  pour Bottom: 0.69,0 0.69,20.2 7.74,20.2 9.04,18.9 10.88,18.9 10.88,16.45 14.1,16.45 15.52,17.87 15.52,25.15 20.24,25.15 20.24,21.1 22.14,19.2 24.69,19.2 24.69,-0.05 0.69,-0.05
VDDANA
  Top 0.203: U1.6 15.34,17 15.34,15.75 15.85,15.24 C7.1
  Top 0.254: C7.1 C8.1 FB.2
VHI
  Bottom 0.305: 13.64,22.74 13.64,22.86 | 13.64,22.86 VREG.3 | 10.73,25.72 11.68,24.78 C9.2 11.74,24.59 VREG.1 11.74,22.86 11.74,22.74 12.23,22.25 12.39,22.25 12.44,22.2 12.98,22.2 13.64,22.86 | D2.C 14.01,31.63 D1.C 10.73,28.36 10.73,25.72 | 11.08,25.38 10.73,25.72
VIN
  Bottom 0.305: J4.P3 22.9,19.24 22.18,19.24 19.9,21.52 19.9,24.58 19.26,25.21 16.48,25.21 15.98,25.72 15.98,27.13 14.07,29.04 D2.A
VUSB
  Bottom 0.305: D1.A 11.39,32.33 J1.P1
(copper drawn outside any net)
  shapes: Top circle x2

### Text on the board
bPlace: SWD | ~SCL | SWC | ~SDA | 3V3 | VIN | !RST | 3V3 | GND | GND | RX~ | ~A6 | TX~ | ~A5 | D3~ | ~A4 | D4~ | ~A3 | D5~ | ~A2 | MOSI | A1 | MISO | AREF | SCK~ | A0/VOUT
tNames: SWD | SCL~ | SWC | SDA~ | 3V3 | VIN | !RST | 3V3 | GND | GND | MINI | RESET | BUTTON
bNames: R5 | https:// / minisam.cc | rev: 001 / bld: 014
tStop: MEM | STATUS | SAM | D51